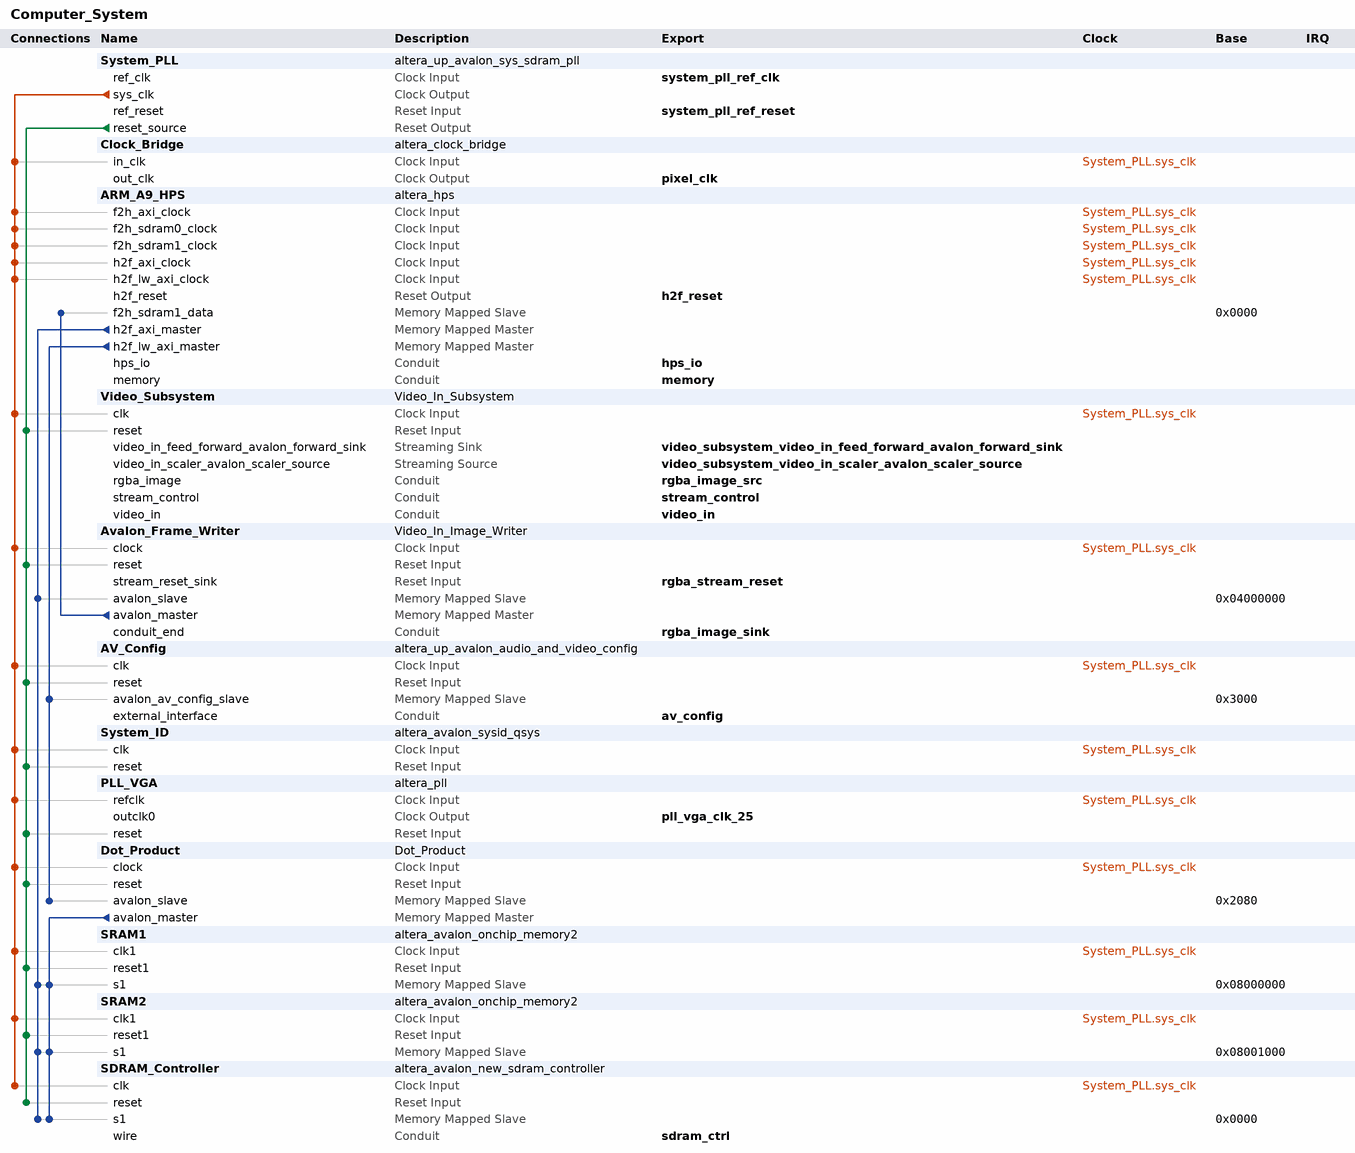
[diagram p0: system contents]
# Platform Designer (Qsys) system Computer_System, Cyclone V 5CSEMA5F31C6
# Parameters at their usual value, and those the tool derives, are not listed.
package require -exact qsys 17.1
create_system Computer_System
set_project_property DEVICE_FAMILY {Cyclone V}
set_project_property DEVICE 5CSEMA5F31C6

add_instance System_PLL altera_up_avalon_sys_sdram_pll 17.1
set_instance_parameter_value System_PLL CV_boards DE1-SoC
set_instance_parameter_value System_PLL gui_outclk 100.0
set_instance_parameter_value System_PLL gui_refclk 50.0

add_instance Clock_Bridge altera_clock_bridge 17.1
set_instance_parameter_value Clock_Bridge DERIVED_CLOCK_RATE 100000000
set_instance_parameter_value Clock_Bridge EXPLICIT_CLOCK_RATE 0

add_instance ARM_A9_HPS altera_hps 17.1
set_instance_parameter_value ARM_A9_HPS EMAC1_Mode RGMII
set_instance_parameter_value ARM_A9_HPS EMAC1_PinMuxing {HPS I/O Set 0}
set_instance_parameter_value ARM_A9_HPS F2SCLK_COLDRST_Enable false
set_instance_parameter_value ARM_A9_HPS F2SCLK_DBGRST_Enable false
set_instance_parameter_value ARM_A9_HPS F2SCLK_WARMRST_Enable false
set_instance_parameter_value ARM_A9_HPS F2SDRAM_Type {Avalon-MM Bidirectional,Avalon-MM Write-Only}
set_instance_parameter_value ARM_A9_HPS F2SDRAM_Width 128,128
set_instance_parameter_value ARM_A9_HPS F2SINTERRUPT_Enable true
set_instance_parameter_value ARM_A9_HPS F2S_Width 3
set_instance_parameter_value ARM_A9_HPS FPGA_PERIPHERAL_OUTPUT_CLOCK_FREQ_EMAC0_GTX_CLK 125
set_instance_parameter_value ARM_A9_HPS FPGA_PERIPHERAL_OUTPUT_CLOCK_FREQ_EMAC0_MD_CLK 2.5
set_instance_parameter_value ARM_A9_HPS FPGA_PERIPHERAL_OUTPUT_CLOCK_FREQ_EMAC1_GTX_CLK 125
set_instance_parameter_value ARM_A9_HPS FPGA_PERIPHERAL_OUTPUT_CLOCK_FREQ_EMAC1_MD_CLK 2.5
set_instance_parameter_value ARM_A9_HPS HPS_PROTOCOL DDR3
set_instance_parameter_value ARM_A9_HPS I2C0_Mode I2C
set_instance_parameter_value ARM_A9_HPS I2C0_PinMuxing {HPS I/O Set 0}
set_instance_parameter_value ARM_A9_HPS I2C1_Mode I2C
set_instance_parameter_value ARM_A9_HPS I2C1_PinMuxing {HPS I/O Set 0}
set_instance_parameter_value ARM_A9_HPS LWH2F_Enable true
set_instance_parameter_value ARM_A9_HPS MEM_BANKADDR_WIDTH 3
set_instance_parameter_value ARM_A9_HPS MEM_CLK_FREQ 400.0
set_instance_parameter_value ARM_A9_HPS MEM_COL_ADDR_WIDTH 10
set_instance_parameter_value ARM_A9_HPS MEM_DQ_WIDTH 32
set_instance_parameter_value ARM_A9_HPS MEM_DRV_STR RZQ/7
set_instance_parameter_value ARM_A9_HPS MEM_ROW_ADDR_WIDTH 15
set_instance_parameter_value ARM_A9_HPS MEM_RTT_NOM RZQ/4
set_instance_parameter_value ARM_A9_HPS MEM_RTT_WR RZQ/4
set_instance_parameter_value ARM_A9_HPS MEM_TCL 11
set_instance_parameter_value ARM_A9_HPS MEM_TFAW_NS 30.0
set_instance_parameter_value ARM_A9_HPS MEM_TRAS_NS 35.0
set_instance_parameter_value ARM_A9_HPS MEM_TRCD_NS 13.75
set_instance_parameter_value ARM_A9_HPS MEM_TRFC_NS 260.0
set_instance_parameter_value ARM_A9_HPS MEM_TRP_NS 13.75
set_instance_parameter_value ARM_A9_HPS MEM_VENDOR Micron
set_instance_parameter_value ARM_A9_HPS MEM_WTCL 8
set_instance_parameter_value ARM_A9_HPS QSPI_Mode {1 SS}
set_instance_parameter_value ARM_A9_HPS QSPI_PinMuxing {HPS I/O Set 0}
set_instance_parameter_value ARM_A9_HPS REF_CLK_FREQ 25.0
set_instance_parameter_value ARM_A9_HPS S2FCLK_USER2CLK 5
set_instance_parameter_value ARM_A9_HPS S2F_Width 3
set_instance_parameter_value ARM_A9_HPS SDIO_Mode {4-bit Data}
set_instance_parameter_value ARM_A9_HPS SDIO_PinMuxing {HPS I/O Set 0}
set_instance_parameter_value ARM_A9_HPS SPIM1_Mode {Single Slave Select}
set_instance_parameter_value ARM_A9_HPS SPIM1_PinMuxing {HPS I/O Set 0}
set_instance_parameter_value ARM_A9_HPS STM_Enable false
set_instance_parameter_value ARM_A9_HPS TIMING_BOARD_AC_SKEW 0.02
set_instance_parameter_value ARM_A9_HPS TIMING_BOARD_AC_TO_CK_SKEW 0.01
set_instance_parameter_value ARM_A9_HPS TIMING_BOARD_DQ_TO_DQS_SKEW 0.05
set_instance_parameter_value ARM_A9_HPS TIMING_BOARD_MAX_CK_DELAY 0.03
set_instance_parameter_value ARM_A9_HPS TIMING_BOARD_MAX_DQS_DELAY 0.02
set_instance_parameter_value ARM_A9_HPS TIMING_BOARD_SKEW_BETWEEN_DQS 0.06
set_instance_parameter_value ARM_A9_HPS TIMING_BOARD_SKEW_CKDQS_DIMM_MAX 0.12
set_instance_parameter_value ARM_A9_HPS TIMING_BOARD_SKEW_CKDQS_DIMM_MIN 0.06
set_instance_parameter_value ARM_A9_HPS TIMING_BOARD_SKEW_WITHIN_DQS 0.01
set_instance_parameter_value ARM_A9_HPS TIMING_TDH 65
set_instance_parameter_value ARM_A9_HPS TIMING_TDQSCK 255
set_instance_parameter_value ARM_A9_HPS TIMING_TDQSQ 125
set_instance_parameter_value ARM_A9_HPS TIMING_TDS 30
set_instance_parameter_value ARM_A9_HPS TIMING_TIH 140
set_instance_parameter_value ARM_A9_HPS TIMING_TIS 180
set_instance_parameter_value ARM_A9_HPS TIMING_TQSH 0.4
set_instance_parameter_value ARM_A9_HPS UART0_Mode {No Flow Control}
set_instance_parameter_value ARM_A9_HPS UART0_PinMuxing {HPS I/O Set 0}
set_instance_parameter_value ARM_A9_HPS USB1_Mode SDR
set_instance_parameter_value ARM_A9_HPS USB1_PinMuxing {HPS I/O Set 0}
set_instance_parameter_value ARM_A9_HPS desired_cfg_clk_mhz 100.0
set_instance_parameter_value ARM_A9_HPS desired_qspi_clk_mhz 400.0

add_instance Video_Subsystem Video_In_Subsystem 1.0

add_instance Avalon_Frame_Writer Video_In_Image_Writer 1.0
set_instance_parameter_value Avalon_Frame_Writer COMPONENT_SIZE 8
set_instance_parameter_value Avalon_Frame_Writer NUMBER_COMPONENTS 4
set_instance_parameter_value Avalon_Frame_Writer PIX_WR 4

add_instance AV_Config altera_up_avalon_audio_and_video_config 17.1
set_instance_parameter_value AV_Config audio_in {Microphone to ADC}
set_instance_parameter_value AV_Config bit_length 32
set_instance_parameter_value AV_Config board DE10-Standard
set_instance_parameter_value AV_Config line_in_bypass true
set_instance_parameter_value AV_Config sampling_rate {48 kHz}

add_instance System_ID altera_avalon_sysid_qsys 17.1
set_instance_parameter_value System_ID id 0

add_instance PLL_VGA altera_pll 17.1
set_instance_parameter_value PLL_VGA gui_actual_output_clock_frequency0 {25.175644 MHz}
set_instance_parameter_value PLL_VGA gui_device_speed_grade 1
set_instance_parameter_value PLL_VGA gui_number_of_clocks 1
set_instance_parameter_value PLL_VGA gui_operation_mode direct
set_instance_parameter_value PLL_VGA gui_output_clock_frequency0 25.175
set_instance_parameter_value PLL_VGA gui_pll_mode {Integer-N PLL}
set_instance_parameter_value PLL_VGA gui_reference_clock_frequency 100.0
set_instance_parameter_value PLL_VGA gui_use_locked false

add_instance Dot_Product Dot_Product 1.0

add_instance SRAM1 altera_avalon_onchip_memory2 17.1
set_instance_parameter_value SRAM1 dataWidth 32
set_instance_parameter_value SRAM1 dualPort false
set_instance_parameter_value SRAM1 initMemContent true
set_instance_parameter_value SRAM1 initializationFileName onchip_mem.hex
set_instance_parameter_value SRAM1 memorySize 4096

add_instance SRAM2 altera_avalon_onchip_memory2 17.1
set_instance_parameter_value SRAM2 dataWidth 32
set_instance_parameter_value SRAM2 dualPort false
set_instance_parameter_value SRAM2 initMemContent true
set_instance_parameter_value SRAM2 initializationFileName onchip_mem.hex
set_instance_parameter_value SRAM2 memorySize 4096

add_instance SDRAM_Controller altera_avalon_new_sdram_controller 17.1
set_instance_parameter_value SDRAM_Controller TAC 5.5
set_instance_parameter_value SDRAM_Controller TRCD 20.0
set_instance_parameter_value SDRAM_Controller TRP 20.0
set_instance_parameter_value SDRAM_Controller casLatency 3
set_instance_parameter_value SDRAM_Controller columnWidth 10
set_instance_parameter_value SDRAM_Controller dataWidth 16
set_instance_parameter_value SDRAM_Controller generateSimulationModel true
set_instance_parameter_value SDRAM_Controller model single_Micron_MT48LC4M32B2_7_chip
set_instance_parameter_value SDRAM_Controller numberOfBanks 4
set_instance_parameter_value SDRAM_Controller numberOfChipSelects 1
set_instance_parameter_value SDRAM_Controller powerUpDelay 100.0
set_instance_parameter_value SDRAM_Controller refreshPeriod 15.625
set_instance_parameter_value SDRAM_Controller rowWidth 13

# connections
add_connection System_PLL.sys_clk ARM_A9_HPS.f2h_axi_clock clock
add_connection System_PLL.sys_clk ARM_A9_HPS.f2h_sdram0_clock clock
add_connection System_PLL.sys_clk ARM_A9_HPS.f2h_sdram1_clock clock
add_connection System_PLL.sys_clk ARM_A9_HPS.h2f_axi_clock clock
add_connection System_PLL.sys_clk ARM_A9_HPS.h2f_lw_axi_clock clock
add_connection System_PLL.sys_clk AV_Config.clk clock
add_connection System_PLL.sys_clk Avalon_Frame_Writer.clock clock
add_connection System_PLL.sys_clk Clock_Bridge.in_clk clock
add_connection System_PLL.sys_clk Dot_Product.clock clock
add_connection System_PLL.sys_clk PLL_VGA.refclk clock
add_connection System_PLL.sys_clk SDRAM_Controller.clk clock
add_connection System_PLL.sys_clk SRAM1.clk1 clock
add_connection System_PLL.sys_clk SRAM2.clk1 clock
add_connection System_PLL.sys_clk System_ID.clk clock
add_connection System_PLL.sys_clk Video_Subsystem.clk clock
add_connection System_PLL.reset_source AV_Config.reset reset
add_connection System_PLL.reset_source Avalon_Frame_Writer.reset reset
add_connection System_PLL.reset_source Dot_Product.reset reset
add_connection System_PLL.reset_source PLL_VGA.reset reset
add_connection System_PLL.reset_source SDRAM_Controller.reset reset
add_connection System_PLL.reset_source SRAM1.reset1 reset
add_connection System_PLL.reset_source SRAM2.reset1 reset
add_connection System_PLL.reset_source System_ID.reset reset
add_connection System_PLL.reset_source Video_Subsystem.reset reset
add_connection ARM_A9_HPS.h2f_axi_master Avalon_Frame_Writer.avalon_slave avalon
set_connection_parameter_value ARM_A9_HPS.h2f_axi_master/Avalon_Frame_Writer.avalon_slave baseAddress 0x04000000
add_connection ARM_A9_HPS.h2f_axi_master SDRAM_Controller.s1 avalon
set_connection_parameter_value ARM_A9_HPS.h2f_axi_master/SDRAM_Controller.s1 baseAddress 0x0000
add_connection ARM_A9_HPS.h2f_axi_master SRAM1.s1 avalon
set_connection_parameter_value ARM_A9_HPS.h2f_axi_master/SRAM1.s1 baseAddress 0x08000000
add_connection ARM_A9_HPS.h2f_axi_master SRAM2.s1 avalon
set_connection_parameter_value ARM_A9_HPS.h2f_axi_master/SRAM2.s1 baseAddress 0x08001000
add_connection ARM_A9_HPS.h2f_lw_axi_master AV_Config.avalon_av_config_slave avalon
set_connection_parameter_value ARM_A9_HPS.h2f_lw_axi_master/AV_Config.avalon_av_config_slave baseAddress 0x3000
add_connection ARM_A9_HPS.h2f_lw_axi_master Dot_Product.avalon_slave avalon
set_connection_parameter_value ARM_A9_HPS.h2f_lw_axi_master/Dot_Product.avalon_slave baseAddress 0x2080
add_connection Avalon_Frame_Writer.avalon_master ARM_A9_HPS.f2h_sdram1_data avalon
set_connection_parameter_value Avalon_Frame_Writer.avalon_master/ARM_A9_HPS.f2h_sdram1_data baseAddress 0x0000
add_connection Dot_Product.avalon_master SDRAM_Controller.s1 avalon
set_connection_parameter_value Dot_Product.avalon_master/SDRAM_Controller.s1 baseAddress 0x0000
add_connection Dot_Product.avalon_master SRAM1.s1 avalon
set_connection_parameter_value Dot_Product.avalon_master/SRAM1.s1 baseAddress 0x08000000
add_connection Dot_Product.avalon_master SRAM2.s1 avalon
set_connection_parameter_value Dot_Product.avalon_master/SRAM2.s1 baseAddress 0x08001000

# exported interfaces
add_interface av_config conduit end
set_interface_property av_config EXPORT_OF AV_Config.external_interface
add_interface h2f_reset reset source
set_interface_property h2f_reset EXPORT_OF ARM_A9_HPS.h2f_reset
add_interface hps_io conduit end
set_interface_property hps_io EXPORT_OF ARM_A9_HPS.hps_io
add_interface memory conduit end
set_interface_property memory EXPORT_OF ARM_A9_HPS.memory
add_interface pixel_clk clock source
set_interface_property pixel_clk EXPORT_OF Clock_Bridge.out_clk
add_interface pll_vga_clk_25 clock source
set_interface_property pll_vga_clk_25 EXPORT_OF PLL_VGA.outclk0
add_interface rgba_image_sink conduit end
set_interface_property rgba_image_sink EXPORT_OF Avalon_Frame_Writer.conduit_end
add_interface rgba_image_src conduit end
set_interface_property rgba_image_src EXPORT_OF Video_Subsystem.rgba_image
add_interface rgba_stream_reset reset sink
set_interface_property rgba_stream_reset EXPORT_OF Avalon_Frame_Writer.stream_reset_sink
add_interface sdram_ctrl conduit end
set_interface_property sdram_ctrl EXPORT_OF SDRAM_Controller.wire
add_interface stream_control conduit end
set_interface_property stream_control EXPORT_OF Video_Subsystem.stream_control
add_interface system_pll_ref_clk clock sink
set_interface_property system_pll_ref_clk EXPORT_OF System_PLL.ref_clk
add_interface system_pll_ref_reset reset sink
set_interface_property system_pll_ref_reset EXPORT_OF System_PLL.ref_reset
add_interface video_in conduit end
set_interface_property video_in EXPORT_OF Video_Subsystem.video_in
add_interface video_subsystem_video_in_feed_forward_avalon_forward_sink avalon_streaming sink
set_interface_property video_subsystem_video_in_feed_forward_avalon_forward_sink EXPORT_OF Video_Subsystem.video_in_feed_forward_avalon_forward_sink
add_interface video_subsystem_video_in_scaler_avalon_scaler_source avalon_streaming source
set_interface_property video_subsystem_video_in_scaler_avalon_scaler_source EXPORT_OF Video_Subsystem.video_in_scaler_avalon_scaler_source

set_interconnect_requirement {$system} qsys_mm.clockCrossingAdapter HANDSHAKE
set_interconnect_requirement {$system} qsys_mm.enableEccProtection FALSE
set_interconnect_requirement {$system} qsys_mm.insertDefaultSlave FALSE
set_interconnect_requirement {$system} qsys_mm.maxAdditionalLatency 1

save_system Computer_System.qsys
